# Altium schematic sheet 06_interface.SchDoc
size 513 x 386 mm
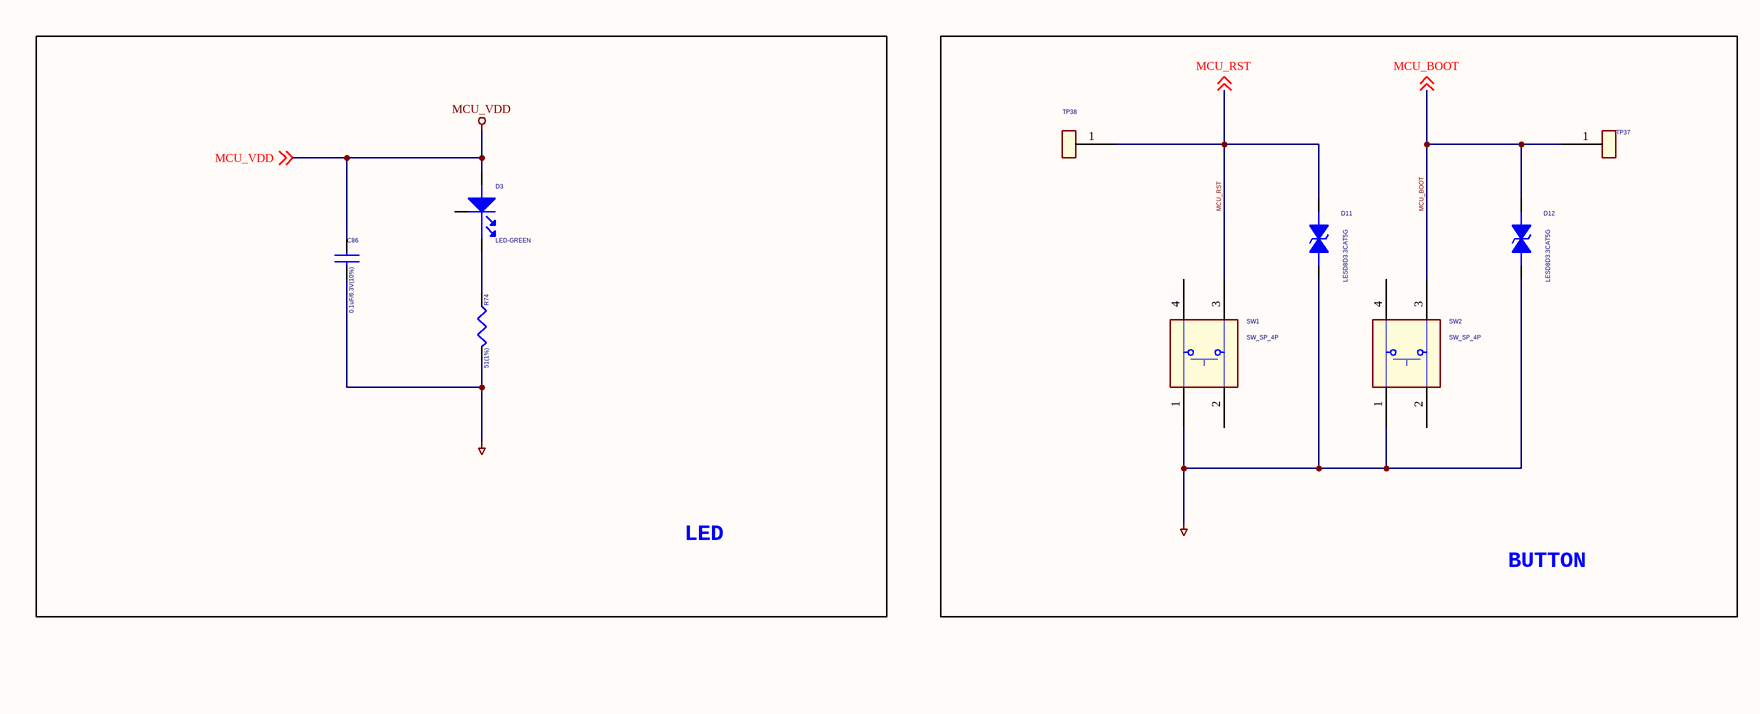
[diagram p0: 06_interface.SchDoc, left]
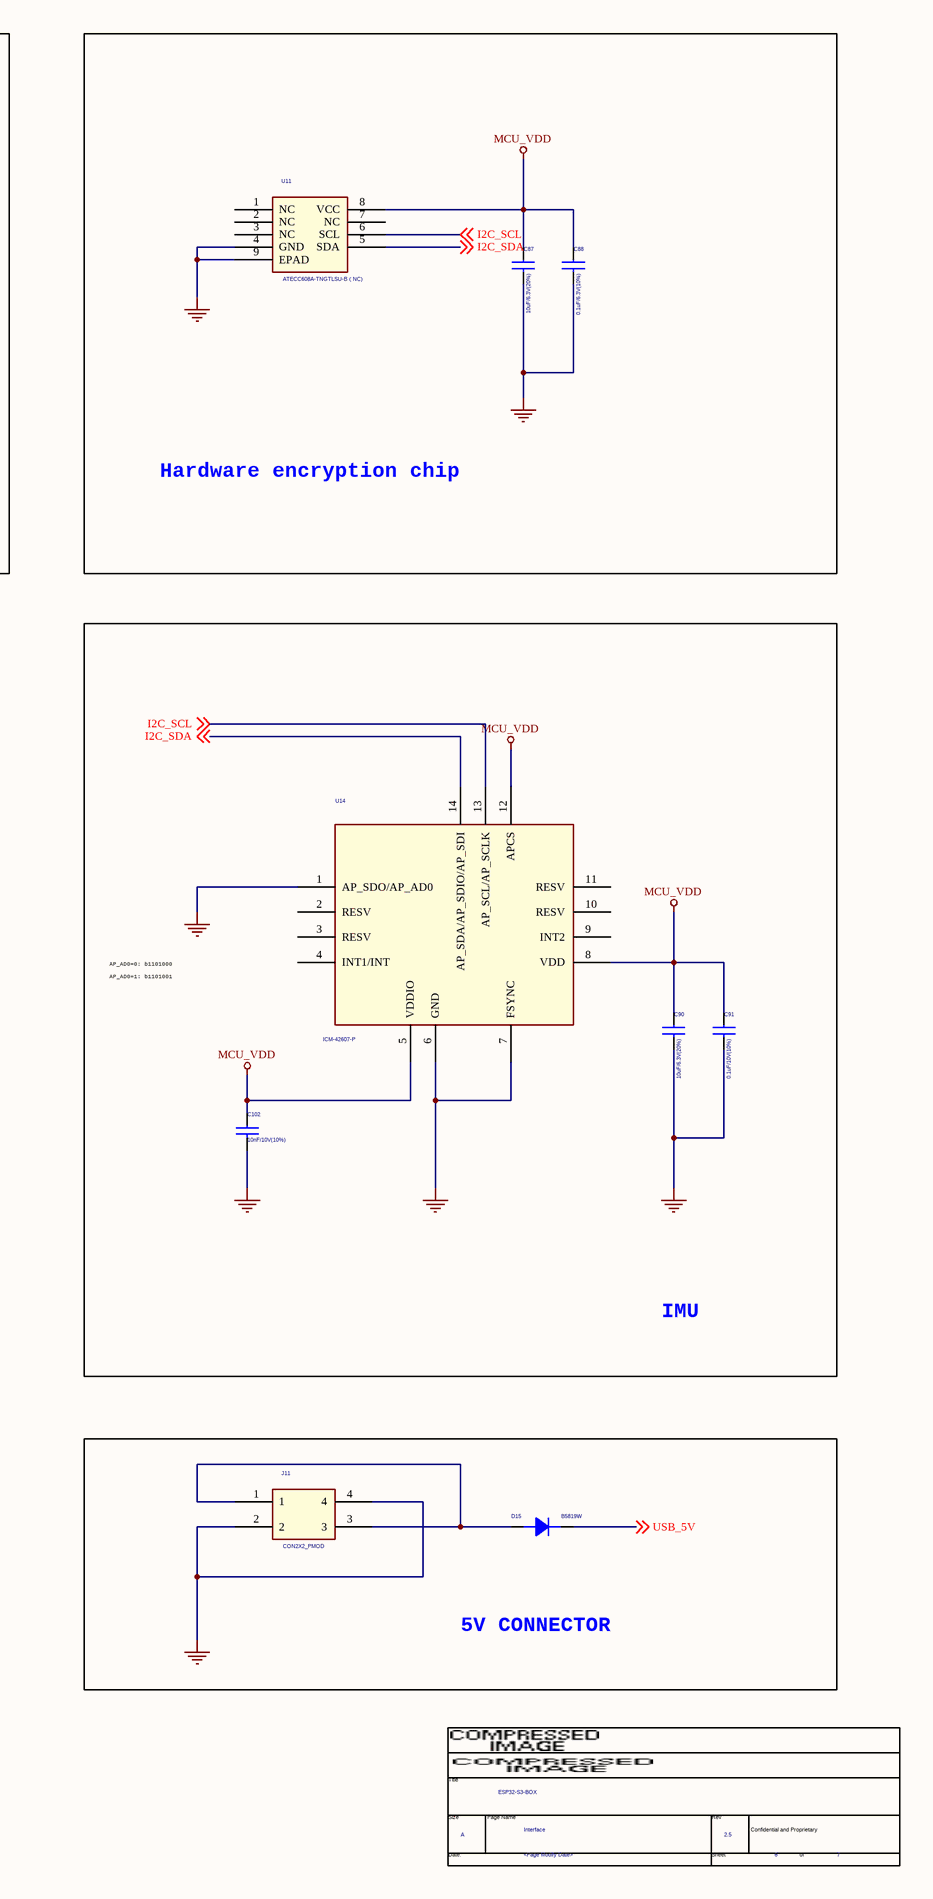
[diagram p1: 06_interface.SchDoc, right]

## Parts
*  Page Modify Date: <Page Modify Date>  Page Name: Interface  Title: ESP32-S3-BOX  Page Size: A  Page Number: 6  Page Count: 7  RevCode: 2.5  (hidden comment: espTitleBlock3)  (graphical)
C86  0.1uF/6.3V(10%)  [C0402]
C87  10uF/6.3V(20%)  [C0402]
C88  0.1uF/6.3V(10%)  [C0402]
C90  10uF/6.3V(20%)  [C0402]
C91  0.1uF/10V(10%)  [C0201]
C102  10nF/10V(10%)  [C0201]
D3  LED-GREEN  [LED_SMD1206]
D11  LESD8D3.3CAT5G  [SOD882]
D12  LESD8D3.3CAT5G  [SOD882]
D15  B5819W  [SOD123]
J11  CON2X2_PMOD  [CON2X2_PMOD]
R74  51(1%)  [R0201]
SW1  SW_SP_4P  [SW4-3X3P5X1P1-SMT]
SW2  SW_SP_4P  [SW4-3X3P5X1P1-SMT]
TP37  TESTPOINT  [TPC_D40]  (value not drawn)
TP38  TESTPOINT  [TPC_D40]  (value not drawn)
U11  ATECC608A-TNGTLSU-B（NC)  [DFN8_0P5_2P4]
U14  ICM-42607-P  [LGA14_0P5]

## Blocks framed on the sheet
LED: C86 D3 R74
BUTTON: D11 D12 SW1 SW2 TP37 TP38
Hardware encryption chip: C87 C88 U11
IMU: C90 C91 C102 U14
5V CONNECTOR: D15 J11

## Nets
GND: C86.2 C87.2 C88.2 C90.2 C91.2 C102.2 D11.1 D12.1 J11.2 J11.4 R74.2 SW1.1 SW2.1 U11.4(GND) U11.9(EPAD) U14.1(AP_SDO/AP_AD0) U14.6(GND) U14.7(FSYNC)
MCU_VDD: C86.1 C87.1 C88.1 C90.1 C91.1 C102.1 D3.1 U11.8(VCC) U14.5(VDDIO) U14.8(VDD) U14.12(APCS) ; off-sheet MCU_VDD
I2C_SCL: U11.6(SCL) U14.13(AP_SCL/AP_SCLK) ; off-sheet I2C_SCL
I2C_SDA: U11.5(SDA) U14.14(AP_SDA/AP_SDIO/AP_SDI) ; off-sheet I2C_SDA
MCU_BOOT: D12.2 SW2.3 TP37.1 ; off-sheet MCU_BOOT
MCU_RST: D11.2 SW1.3 TP38.1 ; off-sheet MCU_RST
USB_5V: D15.2(K) ; off-sheet USB_5V
NetD3_2: D3.2 R74.1
NetD15_1: D15.1(A) J11.1 J11.3

Not connected (* = marked no-connect by the designer): D3 3; SW1 2 4; SW2 2 4; U11 1(NC) 2(NC) 3(NC) 7(NC); U14 2(RESV) 3(RESV) 4(INT1/INT) 9(INT2) 10(RESV) 11(RESV)

## Notes on the sheet
- AP_AD0=0: b1101000
- AP_AD0=1: b1101001
- (in symbol espTitleBlock3) Title; Size; Page Name; Rev; Confidential and Proprietary; Date:; Sheet; of

## Library data of the parts
* = espTitleBlock3: Doc: ESP32-S3-EYE_V1.0; OrgName: ESPRESSIF
C86 C88 = CAPACITOR: Part Number: ES11045102620001; CODE12: ES11.04.510.2.6.2.00; Part Type: Capacitor
C87 C90 = CAPACITOR: Part Number: ES11047102710000; CODE12: ES11.04.710.2.7.1.00; Part Type: Capacitor
C91 = CAPACITOR: Part Number: ES11025103610001; CODE12: ES11.02.510.3.6.1.00; Part Type: Capacitor
C102 = CAPACITOR: Part Number: ES11024103600000; CODE12: ES11.02.410.3.6.0.00; Part Type: Capacitor
D11 D12 = DIODE_BI_DIR: Part Number: ES31320010000000; CODE12: ES31.32.0010.00.0.0; Part Type: Diode
D15 = DIODE_S: Part Number: ES31300150000000; CODE12: ES31.30.0020.00.0.0; Part Type: Diode
R74 = RESISTOR: Part Number: ES21021510000001; CODE12: ES21.02.1510.0.00.0; Part Type: Resistor
SW1 SW2 = SW_SP_4P: CLASS: DISCRETE; TIME: 2004-11-29
TP37 TP38 = TESTPOINT: Part Number: ES51990010000000; CODE12: ES51.99.0010.00.00; Part Type: -
U11 = ATECC608A-TNGTLSU-B